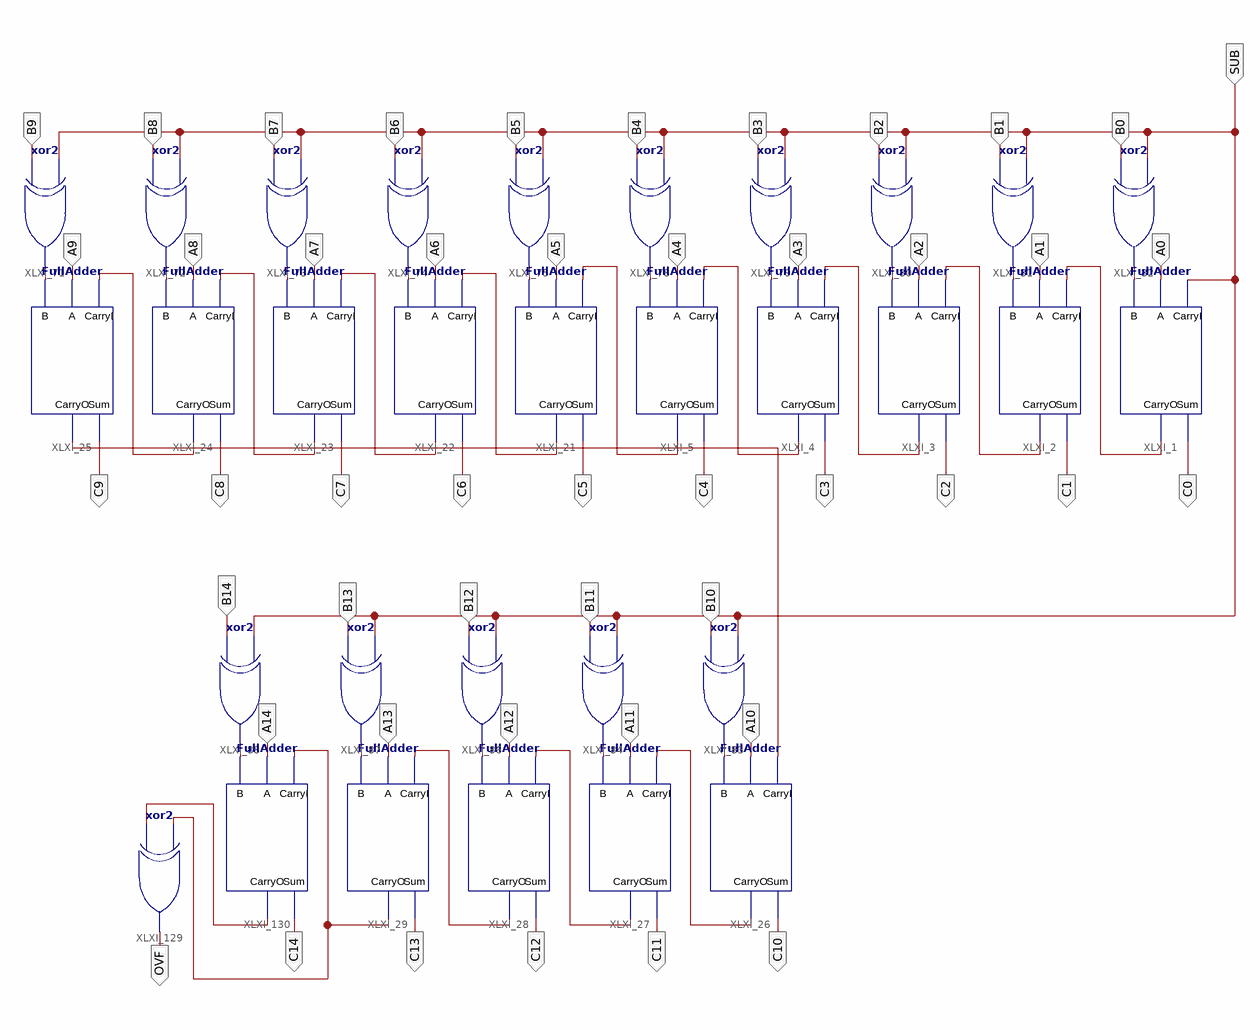
[diagram p0: schematic sheet 1]
// Xilinx ISE schematic Bit15Adder.sch (spartan3e) as structural Verilog: 31 symbols, 47 ports
module Bit15Adder (
  input  SUB,
  input  B14,
  input  B9,
  input  B8,
  input  B7,
  input  B6,
  input  B5,
  input  B4,
  input  B3,
  input  B2,
  input  B1,
  input  B0,
  input  A1,
  input  A2,
  input  A3,
  input  A0,
  input  A4,
  input  A5,
  input  A7,
  input  A6,
  input  A8,
  input  A9,
  input  A14,
  input  A13,
  input  A12,
  input  B12,
  input  B13,
  input  B11,
  input  B10,
  input  A11,
  input  A10,
  output C5,
  output C6,
  output C7,
  output C9,
  output C8,
  output C13,
  output C12,
  output C11,
  output C10,
  output C14,
  output C4,
  output C3,
  output C2,
  output C1,
  output C0,
  output OVF
);

  wire XLXN_16, XLXN_17, XLXN_18, XLXN_19, XLXN_20, XLXN_21, XLXN_22, XLXN_23, XLXN_24, XLXN_25, XLXN_26,
       XLXN_27, XLXN_28, XLXN_29, XLXN_30, XLXN_73, XLXN_75, XLXN_77, XLXN_79, XLXN_81, XLXN_87, XLXN_89,
       XLXN_91, XLXN_98, XLXN_108, XLXN_110, XLXN_112, XLXN_134, XLXN_149, XLXN_155;

  xor XLXI_82 (XLXN_25, B0, SUB);
  xor XLXI_81 (XLXN_24, B1, SUB);
  xor XLXI_80 (XLXN_23, B2, SUB);
  xor XLXI_79 (XLXN_22, B3, SUB);
  xor XLXI_78 (XLXN_21, B4, SUB);
  xor XLXI_75 (XLXN_20, B5, SUB);
  xor XLXI_74 (XLXN_19, B6, SUB);
  xor XLXI_73 (XLXN_18, B7, SUB);
  xor XLXI_72 (XLXN_17, B8, SUB);
  xor XLXI_71 (XLXN_16, B9, SUB);
  FullAdder XLXI_25 (.A(A9), .B(XLXN_16), .CarryI(XLXN_98), .CarryO(XLXN_134), .Sum(C9));
  FullAdder XLXI_24 (.A(A8), .B(XLXN_17), .CarryI(XLXN_91), .CarryO(XLXN_98), .Sum(C8));
  FullAdder XLXI_23 (.A(A7), .B(XLXN_18), .CarryI(XLXN_89), .CarryO(XLXN_91), .Sum(C7));
  FullAdder XLXI_22 (.A(A6), .B(XLXN_19), .CarryI(XLXN_87), .CarryO(XLXN_89), .Sum(C6));
  FullAdder XLXI_21 (.A(A5), .B(XLXN_20), .CarryI(XLXN_81), .CarryO(XLXN_87), .Sum(C5));
  FullAdder XLXI_5 (.A(A4), .B(XLXN_21), .CarryI(XLXN_79), .CarryO(XLXN_81), .Sum(C4));
  FullAdder XLXI_4 (.A(A3), .B(XLXN_22), .CarryI(XLXN_77), .CarryO(XLXN_79), .Sum(C3));
  FullAdder XLXI_3 (.A(A2), .B(XLXN_23), .CarryI(XLXN_75), .CarryO(XLXN_77), .Sum(C2));
  FullAdder XLXI_2 (.A(A1), .B(XLXN_24), .CarryI(XLXN_73), .CarryO(XLXN_75), .Sum(C1));
  FullAdder XLXI_1 (.A(A0), .B(XLXN_25), .CarryI(SUB), .CarryO(XLXN_73), .Sum(C0));
  FullAdder XLXI_26 (.A(A10), .B(XLXN_26), .CarryI(XLXN_134), .CarryO(XLXN_112), .Sum(C10));
  FullAdder XLXI_27 (.A(A11), .B(XLXN_27), .CarryI(XLXN_112), .CarryO(XLXN_110), .Sum(C11));
  FullAdder XLXI_28 (.A(A12), .B(XLXN_28), .CarryI(XLXN_110), .CarryO(XLXN_108), .Sum(C12));
  FullAdder XLXI_29 (.A(A13), .B(XLXN_29), .CarryI(XLXN_108), .CarryO(XLXN_149), .Sum(C13));
  xor XLXI_83 (XLXN_26, B10, SUB);
  xor XLXI_84 (XLXN_27, B11, SUB);
  xor XLXI_86 (XLXN_28, B12, SUB);
  xor XLXI_87 (XLXN_29, B13, SUB);
  xor XLXI_88 (XLXN_30, B14, SUB);
  xor XLXI_129 (OVF, XLXN_155, XLXN_149);
  FullAdder XLXI_130 (.A(A14), .B(XLXN_30), .CarryI(XLXN_149), .CarryO(XLXN_155), .Sum(C14));
endmodule
